# Altium project Spinal_Project.PrjPcb
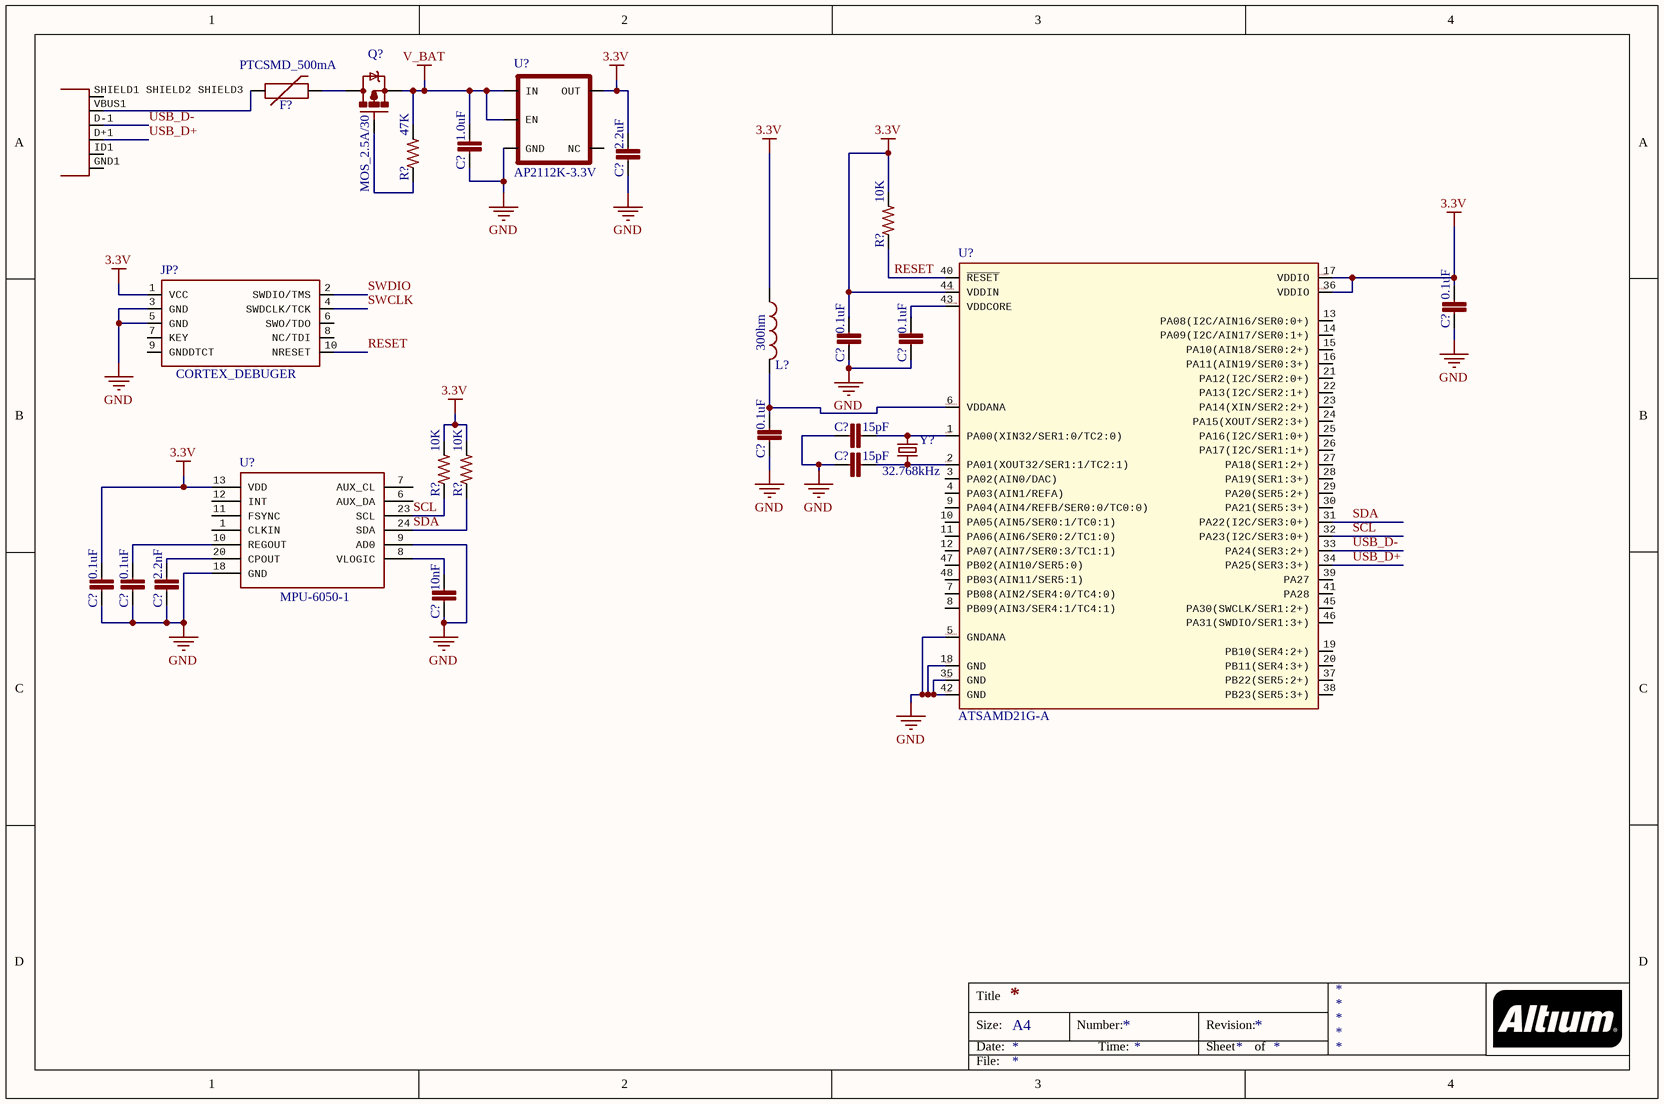
[diagram p0: Schematic.SchDoc]
1 sheet, 25 parts. Net scope: global (net labels, ports and power ports of the same name join across sheets).

## Sheet Schematic.SchDoc
size A4; Time: Project Spinal

### Parts
(Parts that share a designator on the sheet are numbered #1, #2 ... from top to bottom, then left to right.)
C?#1  1.0uF  [C0805]
C?#2  2.2uF  [C0805]
C?#3  0.1uF  [C0805]
C?#4  0.1uF  [C0805]
C?#5  0.1uF  [C0805]
C?#6  15pF  [C0805]
C?#7  0.1uF  [C0805]
C?#8  15pF  [C0805]
C?#9  0.1uF  [C0805]
C?#10  0.1uF  [C0805]
C?#11  2.2nF  [C0805]
C?#12  10nF  [C0805]
F?  PTCSMD_500mA  [PTC-1206]
JP?#1  USB-ABCONN-11794  [USB-AB-MICRO-SMD_V03]  (value not drawn)
JP?#2  CORTEX_DEBUGER  [2X5-PTH-1.27MM]
L?  300hm  [L0805]
Q?  MOS_2.5A/30  [SOT23-3]
R?#1  47K  [R0805]
R?#2  10K  [R0805]
R?#3  10K  [R0805]
R?#4  10K  [R0805]
U?#1  AP2112K-3.3V  [SOT23-5]
U?#2  ATSAMD21G-A  [TQFP-48]
U?#3  MPU-6050-1  [QFN-24-4MM2]
Y?  32.768kHz  [CRYSTAL-SMD-3.2X1.5MM]

### Nets
GND: C?#1.1 C?#2.1 C?#3.2 C?#4.1 C?#5.1 C?#6.2 C?#7.1 C?#8.2 C?#9.1 C?#10.1 C?#11.1 C?#12.1 JP?#2.3(GND) JP?#2.5(GND) U?#1.2(GND) U?#2.5(GNDANA) U?#2.18(GND) U?#2.35(GND) U?#2.42(GND) U?#3.9(AD0) U?#3.18(GND)  [also labelled GNDANA]
V_BAT: C?#1.2 Q?.2(S) R?#1.2 U?#1.1(IN) U?#1.3(EN)
VDDIN: C?#2.2 C?#3.1 C?#4.2 C?#9.2 JP?#2.1(VCC) L?.1 R?#2.2 R?#3.2 R?#4.2 U?#1.5(OUT) U?#2.17(VDDIO) U?#2.36(VDDIO) U?#2.44(VDDIN) U?#3.13(VDD)  [also labelled 3.3V]
PA01: C?#8.1 U?#2.2(PA01(XOUT32/SER1:1/TC2:1)) Y?.P$1
PO00: C?#6.1 U?#2.1(PA00(XIN32/SER1:0/TC2:0)) Y?.P$2
RESET: JP?#2.10(NRESET) R?#2.1 U?#2.40(~{RESET})
SCL: R?#3.1 U?#2.32(PA23(I2C/SER3:0+)) U?#3.23(SCL)
SDA: R?#4.1 U?#2.31(PA22(I2C/SER3:0+)) U?#3.24(SDA)
SWCLK: JP?#2.4(SWDCLK/TCK)
SWDIO: JP?#2.2(SWDIO/TMS)
USB_D+: JP?#1.D+1(D+) U?#2.34(PA25(SER3:3+))
USB_D-: JP?#1.D-1(D-) U?#2.33(PA24(SER3:2+))
VDDANA: C?#7.2 L?.2 U?#2.6(VDDANA)
VDDCORE: C?#5.2 U?#2.43(VDDCORE)
NetC?#10_2: C?#10.2 U?#3.10(REGOUT)
NetC?#11_2: C?#11.2 U?#3.20(CPOUT)
NetC?#12_2: C?#12.2 U?#3.8(VLOGIC)
NetF?_1: F?.1 JP?#1.VBUS1(VBUS)
NetF?_2: F?.2 Q?.3(D)
NetQ?_1: Q?.1(G) R?#1.1

Not connected (* = marked no-connect by the designer): JP?#1 GND1(GND) ID1(USBID) SHIELD1 SHIELD2 SHIELD3(SHIELD); JP?#2 6(SWO/TDO) 7(KEY) 8(NC/TDI) 9(GNDDTCT); U?#1 4(NC); U?#2 3(PA02(AIN0/DAC)) 4(PA03(AIN1/REFA)) 7(PB08(AIN2/SER4:0/TC4:0)) 8(PB09(AIN3/SER4:1/TC4:1)) 9(PA04(AIN4/REFB/SER0:0/TC0:0)) 10(PA05(AIN5/SER0:1/TC0:1)) 11(PA06(AIN6/SER0:2/TC1:0)) 12(PA07(AIN7/SER0:3/TC1:1)) 13(PA08(I2C/AIN16/SER0:0+)) 14(PA09(I2C/AIN17/SER0:1+)) 15(PA10(AIN18/SER0:2+)) 16(PA11(AIN19/SER0:3+)) 19(PB10(SER4:2+)) 20(PB11(SER4:3+)) 21(PA12(I2C/SER2:0+)) 22(PA13(I2C/SER2:1+)) 23(PA14(XIN/SER2:2+)) 24(PA15(XOUT/SER2:3+)) 25(PA16(I2C/SER1:0+)) 26(PA17(I2C/SER1:1+)) 27(PA18(SER1:2+)) 28(PA19(SER1:3+)) 29(PA20(SER5:2+)) 30(PA21(SER5:3+)) 37(PB22(SER5:2+)) 38(PB23(SER5:3+)) 39(PA27) 41(PA28) 45(PA30(SWCLK/SER1:2+)) 46(PA31(SWDIO/SER1:3+)) 47(PB02(AIN10/SER5:0)) 48(PB03(AIN11/SER5:1)); U?#3 1(CLKIN) 6(AUX_DA) 7(AUX_CL) 11(FSYNC) 12(INT)

### Notes on the sheet
- Labels drawn without touching a wire or pin: VDDIO
- Title
- Size:
- Date:
- A4
- Number:
- Time:
- Revision:
- Sheet
- of
- File:

### Library data of the parts
C?#1-C?#12 = Capacity_0805
F? = PTCSMD_500mA: Resettable Fuse
JP?#1 = USB-ABCONN-11794: This is a USB AB connector that is compatible with USB OTG. i.e. this connector can serve as a host or device
JP?#2 = CORTEX_DEBUGPTH
L? = INDUCTOR_0805
R?#1-R?#4 = Resistor_0805
U?#1 = V_REG_AP2112K-3.3V
Y? = Crystal 32.768